# Altium schematic sheet INPUTS_OUTPUTS.SchDoc
size A; SheetNumber: 5; SheetTotal: 5
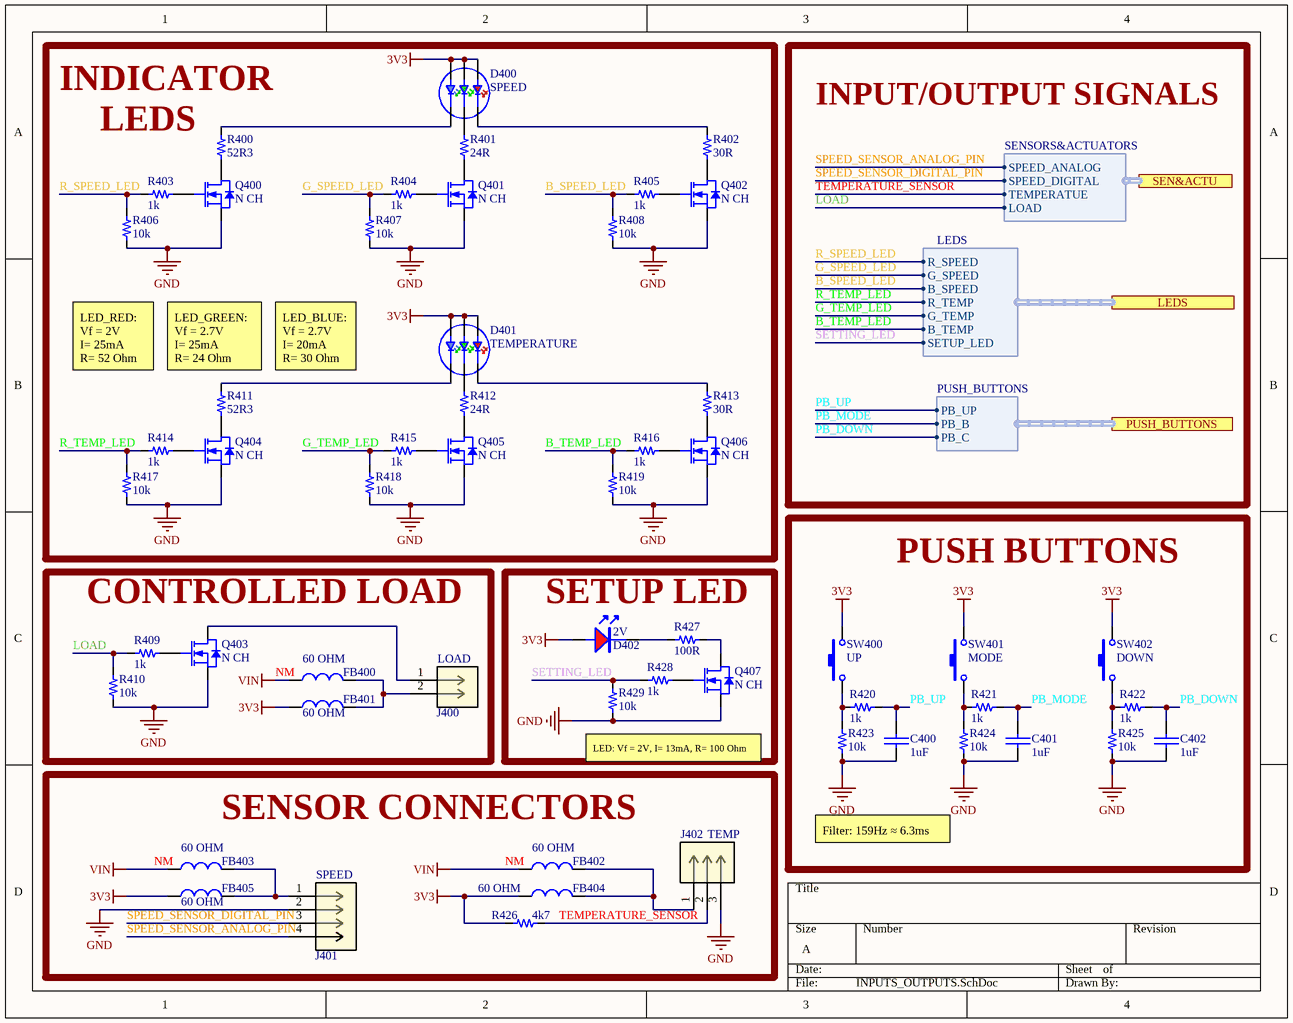
[diagram p0: INPUTS_OUTPUTS.SchDoc]

## Parts
C400  value 1uF  [0603_cap]  (hidden comment: 1uF 50V)
C401  value 1uF  [0603_cap]  (hidden comment: 1uF 50V)
C402  value 1uF  [0603_cap]  (hidden comment: 1uF 50V)
D400  SPEED  [RGB_NS_3.5X3.7]
D401  TEMPERATURE  [RGB_NS_3.5X3.7]
D402  2V  [0805_LED]
FB400  value 60 OHM  Usage: NM  [0603_fb]  (hidden comment: 60OHM 2A)
FB401  value 60 OHM  [0603_fb]  (hidden comment: 60OHM 2A)
FB402  value 60 OHM  Usage: NM  [0603_fb]  (hidden comment: 60OHM 2A)
FB403  value 60 OHM  Usage: NM  [0603_fb]  (hidden comment: 60OHM 2A)
FB404  value 60 OHM  [0603_fb]  (hidden comment: 60OHM 2A)
FB405  value 60 OHM  [0603_fb]  (hidden comment: 60OHM 2A)
J400  LOAD  [CON_2X1_TH_2.54MM]
J401  SPEED  [CON_4X1_TH_2.54MM]
J402  TEMP  [CON_3X1_TH_2.54MM]
Q400  N CH  [SOT_23_3]
Q401  N CH  [SOT_23_3]
Q402  N CH  [SOT_23_3]
Q403  N CH  [SOT_23_3]
Q404  N CH  [SOT_23_3]
Q405  N CH  [SOT_23_3]
Q406  N CH  [SOT_23_3]
Q407  N CH  [SOT_23_3]
R400  value 52R3  [0603_res]  (hidden comment: 52R3 1/10W)
R401  value 24R  [0603_res]  (hidden comment: 24R 1/10W)
R402  value 30R  [0603_res]  (hidden comment: 30 1/10W)
R403  value 1k  [0603_res]  (hidden comment: 1k 1/10W)
R404  value 1k  [0603_res]  (hidden comment: 1k 1/10W)
R405  value 1k  [0603_res]  (hidden comment: 1k 1/10W)
R406  value 10k  [0603_res]  (hidden comment: 10k 1/10W)
R407  value 10k  [0603_res]  (hidden comment: 10k 1/10W)
R408  value 10k  [0603_res]  (hidden comment: 10k 1/10W)
R409  value 1k  [0603_res]  (hidden comment: 1k 1/10W)
R410  value 10k  [0603_res]  (hidden comment: 10k 1/10W)
R411  value 52R3  [0603_res]  (hidden comment: 52R3 1/10W)
R412  value 24R  [0603_res]  (hidden comment: 24R 1/10W)
R413  value 30R  [0603_res]  (hidden comment: 30 1/10W)
R414  value 1k  [0603_res]  (hidden comment: 1k 1/10W)
R415  value 1k  [0603_res]  (hidden comment: 1k 1/10W)
R416  value 1k  [0603_res]  (hidden comment: 1k 1/10W)
R417  value 10k  [0603_res]  (hidden comment: 10k 1/10W)
R418  value 10k  [0603_res]  (hidden comment: 10k 1/10W)
R419  value 10k  [0603_res]  (hidden comment: 10k 1/10W)
R420  value 1k  [0603_res]  (hidden comment: 1k 1/10W)
R421  value 1k  [0603_res]  (hidden comment: 1k 1/10W)
R422  value 1k  [0603_res]  (hidden comment: 1k 1/10W)
R423  value 10k  [0603_res]  (hidden comment: 10k 1/10W)
R424  value 10k  [0603_res]  (hidden comment: 10k 1/10W)
R425  value 10k  [0603_res]  (hidden comment: 10k 1/10W)
R426  value 4k7  [0603_res]  (hidden comment: 4k7 1/10W)
R427  value 100R  [0603_res]  (hidden comment: 100R 1/10W)
R428  value 1k  [0603_res]  (hidden comment: 1k 1/10W)
R429  value 10k  [0603_res]  (hidden comment: 10k 1/10W)
SW400  UP  [Sw_PUSH_4.5x4.5x5mm]
SW401  MODE  [Sw_PUSH_4.5x4.5x5mm]
SW402  DOWN  [Sw_PUSH_4.5x4.5x5mm]

## Blocks framed on the sheet
PUSH BUTTONS: C400-C402 R420-R425 SW400-SW402
CONTROLLED LOAD: FB400 FB401 J400 Q403 R409 R410
SETUP LED: D402 Q407 R427-R429
SENSOR CONNECTORS: FB402-FB405 J401 J402 R426

## Ports
LEDS (harness LEDS, see main[3C], MCU[4C]), PUSH_BUTTONS (harness PUSH_BUTTONS, see main[3C], MCU[4C]), SEN&ACTU (harness SENSORS&ACTUATORS, see main[3C], MCU[4C])

## Harnesses
LEDS: R_SPEED, G_SPEED, B_SPEED, R_TEMP, G_TEMP, B_TEMP, SETUP_LED
SENSORS&ACTUATORS: SPEED_ANALOG, SPEED_DIGITAL, TEMPERATUE, LOAD
PUSH_BUTTONS: PB_UP, PB_B, PB_C

## Nets
3V3: D400.4 D400.5 D400.6 D401.4 D401.5 D401.6 D402.1(A) FB401.1 FB404.1 FB405.1 R426.1 SW400.2 SW401.2 SW402.2
GND: C400.1 C401.1 C402.1 J401.2 J402.3 Q400.2(S) Q401.2(S) Q402.2(S) Q403.2(S) Q404.2(S) Q405.2(S) Q406.2(S) Q407.2(S) R406.1 R407.1 R408.1 R410.1 R417.1 R418.1 R419.1 R423.1 R424.1 R425.1 R429.1
VIN: FB400.1 FB402.1 FB403.1
B_SPEED_LED: R405.1 R408.2 ; port LEDS.B_SPEED
B_TEMP_LED: R416.1 R419.2 ; port LEDS.B_TEMP
G_SPEED_LED: R404.1 R407.2 ; port LEDS.G_SPEED
G_TEMP_LED: R415.1 R418.2 ; port LEDS.G_TEMP
LOAD: R409.1 R410.2 ; port SEN&ACTU.LOAD
PB_DOWN: C402.2 R422.2 ; port PUSH_BUTTONS.PB_C
PB_MODE: C401.2 R421.2 ; port PUSH_BUTTONS.PB_B
PB_UP: C400.2 R420.2 ; port PUSH_BUTTONS.PB_UP
R_SPEED_LED: R403.1 R406.2 ; port LEDS.R_SPEED
R_TEMP_LED: R414.1 R417.2 ; port LEDS.R_TEMP
SETTING_LED: R428.1 R429.2 ; port LEDS.SETUP_LED
SPEED_SENSOR_ANALOG_PIN: J401.4 ; port SEN&ACTU.SPEED_ANALOG
SPEED_SENSOR_DIGITAL_PIN: J401.3 ; port SEN&ACTU.SPEED_DIGITAL
TEMPERATURE_SENSOR: J402.2 R426.2 ; port SEN&ACTU.TEMPERATUE
NetD400_1: D400.1 R400.2
NetD400_2: D400.2 R401.2
NetD400_3: D400.3 R402.2
NetD401_1: D401.1 R411.2
NetD401_2: D401.2 R412.2
NetD401_3: D401.3 R413.2
NetD402_2: D402.2 R427.2
NetFB400_2: FB400.2 FB401.2 J400.2
NetFB402_2: FB402.2 FB404.2 J402.1
NetFB403_2: FB403.2 FB405.2 J401.1
NetJ400_1: J400.1 Q403.3(D)
NetQ400_1: Q400.1(G) R403.2
NetQ400_3: Q400.3(D) R400.1
NetQ401_1: Q401.1(G) R404.2
NetQ401_3: Q401.3(D) R401.1
NetQ402_1: Q402.1(G) R405.2
NetQ402_3: Q402.3(D) R402.1
NetQ403_1: Q403.1(G) R409.2
NetQ404_1: Q404.1(G) R414.2
NetQ404_3: Q404.3(D) R411.1
NetQ405_1: Q405.1(G) R415.2
NetQ405_3: Q405.3(D) R412.1
NetQ406_1: Q406.1(G) R416.2
NetQ406_3: Q406.3(D) R413.1
NetQ407_1: Q407.1(G) R428.2
NetQ407_3: Q407.3(D) R427.1
NetR420_1: R420.1 R423.2 SW400.1
NetR421_1: R421.1 R424.2 SW401.1
NetR422_1: R422.1 R425.2 SW402.1

## Notes on the sheet
- (near R400) INDICATOR
- LEDS
- INPUT/OUTPUT SIGNALS
- LED_RED:
  Vf = 2V
  I= 25mA
  R= 52 Ohm
- (near R411) LED_GREEN:
  Vf = 2.7V
  I= 25mA
  R= 24 Ohm
- LED_BLUE:
  Vf = 2.7V
  I= 20mA
  R= 30 Ohm
- LED: Vf = 2V, I= 13mA, R= 100 Ohm
- Filter: 159Hz ≈ 6.3ms

## Library data of the parts
C400-C402 = Cap_1uF_0603_50V: 50V 1uF X5R ±10% 0603 Multilayer Ceramic Capacitors MLCC - SMD/SMT ROHS; Manufacturer: Samsung Electro-Mechanics; Manufacturer Part Number: CL10A105KB8NNNC; Supplier 1: LCSC; Supplier Part Number 1: C15849; ComponentLink1Description: LCSC; ComponentLink1URL: https://www.lcsc.com/product-detail/Multilayer-Ceramic-Capacitors-MLCC-SMD-SMT_Samsung-Electro-Mechanics-CL10A105KB8NNNC_C15849.html
D400 D401 = LED_RGB_3535_SMD: -30℃~+85℃ RGB 110° 3535(mm) Light Emitting Diodes (LED) ROHS; Manufacturer: Foshan NationStar Optoelectronics; Manufacturer Part Number: RS-3535MWAM; Supplier 1: LCSC; Supplier Part Number 1: C842778; ComponentLink1Description: LCSC; ComponentLink1URL: https://www.lcsc.com/product-detail/Light-Emitting-Diodes-LED_Foshan-NationStar-Optoelectronics-RS-3535MWAM_C842778.html
D402 = LED_0805_RED: LED RED CLEAR 0805 SMD; Manufacturer: XINGLIGHT; Manufacturer Part Number: XL-2012SURC; Supplier 1: LCSC; Supplier Part Number 1: C965812; ComponentLink1Description: LCSC; ComponentLink1URL: https://www.lcsc.com/product-detail/Light-Emitting-Diodes-LED_XINGLIGHT-XL-2012SURC_C965812.html
FB400-FB405 = FB_60_0603_2A: 2A 1 100mΩ 60Ω@100MHz ±25% 0603 Ferrite Beads ROHS; Manufacturer: TAI-TECH; Manufacturer Part Number: HCB1608KF-600T20; ComponentLink1Description: LCSC; ComponentLink1URL: https://www.lcsc.com/product-detail/Ferrite-Beads_TAI-TECH-HCB1608KF-600T20_C369516.html; Supplier 1: LCSC; Supplier Part Number 1: C369516
J400 = Con_2x1_TH_2.54mm: CONN HEADER VERT 2POS 2.54MM; Manufacturer: Amphenol ICC (FCI); Manufacturer Part Number: 10129378-902001BLF; Supplier 1: Digi-Key; Supplier Part Number 1: 10129378-902001BLF-ND; Value: *; ComponentLink1Description: Digi-Key; ComponentLink1URL: https://www.digikey.com/en/products/detail/amphenol-cs-fci/10129378-902001BLF/7915924?s=N4IgTCBcDaIIwAY5gJwGYDsAOAtChYCSAQgDIBiIAugL5A
J401 = Con_4X1_TH_2.54mm: CONN HEADER VERT 4POS 2.54MM; Manufacturer: Amphenol ICC (FCI); Manufacturer Part Number: 10129378-904001BLF; Supplier 1: Digi-Key; Supplier Part Number 1: 10129378-904001BLF-ND; Value: *; ComponentLink1Description: Digi-Key; ComponentLink1URL: https://www.digikey.com/en/products/detail/amphenol-cs-fci/10129378-904001BLF/7915932?s=N4IgTCBcDaIIwAY5gJwGYDsAOAtChALAkgEIAyAYiALoC%2BQA
J402 = Con_3X1_TH_2.54mm: CONN HEADER VERT 3POS 2.54MM; Manufacturer: Amphenol ICC (FCI); Manufacturer Part Number: 10129378-903001BLF; Supplier 1: Digi-Key; Supplier Part Number 1: 10129378-903001BLF-ND; Value: *; ComponentLink1Description: Digi-Key; ComponentLink1URL: https://www.digikey.com/en/products/detail/amphenol-cs-fci/10129378-903001BLF/7915928
Q400-Q407 = Q_NFET_20V_3.2A_SOT23: MOSFET N-CH 20V SOT23; Manufacturer: Doeshare; Manufacturer Part Number: DN2302S; Supplier 1: LCSC; Supplier Part Number 1: C2931750; ComponentLink1Description: LCSC; ComponentLink1URL: https://www.lcsc.com/product-detail/MOSFETs_Doeshare-DN2302S_C2931750.html
R400 R411 = Res_52R3_0603_1/10W_1: RES SMD 52R3 OHM 1% 1/10W 0603; Manufacturer: FOJAN; Manufacturer Part Number: FRC0603F52R3TS; ComponentLink1URL: https://www.lcsc.com/product-detail/Chip-Resistor-Surface-Mount_FOJAN-FRC0603F52R3TS_C2998074.html; Supplier 1: LCSC; Supplier Part Number 1: C2998074; ComponentLink1Description: LCSC
R401 R412 = Res_24R_0603_1/10W: RES SMD 24R OHM 5% 1/10W 0603; Manufacturer: FOJAN; Manufacturer Part Number: FRC0603J240 TS; ComponentLink1URL: https://www.lcsc.com/product-detail/Chip-Resistor-Surface-Mount_FOJAN-FRC0603J240-TS_C2907132.html; Supplier 1: LCSC; Supplier Part Number 1: C2907132; ComponentLink1Description: LCSC
R402 R413 = Res_30R_0603_1/10W: RES SMD 30R OHM 1% 1/10W 0603; Manufacturer: FOJAN; Manufacturer Part Number: FRC0603F30R0TS; ComponentLink1URL: https://www.lcsc.com/product-detail/Chip-Resistor-Surface-Mount_FOJAN-FRC0603F30R0TS_C2907026.html; Supplier 1: LCSC; Supplier Part Number 1: C2907026; ComponentLink1Description: LCSC
R403-R405 R409 R414-R416 R420-R422 R428 = Res_1k_0603_1/10W: RES SMD 1k OHM 5% 1/10W 0603; Manufacturer: FOJAN; Manufacturer Part Number: FRC0603J102 TS; ComponentLink1URL: https://www.lcsc.com/product-detail/Chip-Resistor-Surface-Mount_FOJAN-FRC0603J102-TS_C2907113.html; Supplier 1: LCSC; Supplier Part Number 1: C2907113; ComponentLink1Description: LCSC
R406-R408 R410 R417-R419 R423-R425 R429 = Res_10k_0603_1/10W: RES SMD 10k OHM 5% 1/10W 0603; Manufacturer: FOJAN; Manufacturer Part Number: FRC0603J103TS; ComponentLink1URL: https://www.lcsc.com/product-detail/Chip-Resistor-Surface-Mount_FOJAN-FRC0603J103TS_C2930027.html; Supplier 1: LCSC; Supplier Part Number 1: C2930027; ComponentLink1Description: LCSC
R426 = Res_4k7_0603_1/10W: RES SMD 4k7 OHM 5% 1/10W 0603; Manufacturer: FOJAN; Manufacturer Part Number: FRC0603J472 TS; ComponentLink1URL: https://www.lcsc.com/product-detail/Chip-Resistor-Surface-Mount_FOJAN-FRC0603J472-TS_C2907166.html; Supplier 1: LCSC; Supplier Part Number 1: C2907166; ComponentLink1Description: LCSC
R427 = Res_100R_0603_1/10W: RES SMD 100R OHM 5% 1/10W 0603; Manufacturer: FOJAN; Manufacturer Part Number: FRC0603J101 TS; ComponentLink1URL: https://www.lcsc.com/product-detail/Chip-Resistor-Surface-Mount_FOJAN-FRC0603J101-TS_C2907089.html; Supplier 1: LCSC; Supplier Part Number 1: C2907089; ComponentLink1Description: LCSC
SW400-SW402 = Sw_PUSH_4.5x4.5x5.0xmm: SWITCH TACTILE SPST-NO 0.05A 12V; Manufacturer: BZCN; Manufacturer Part Number: TSC015A05026A; Supplier 1: LCSC; Supplier Part Number 1: C2888509; Last modified by: N-A.Potosi; Last modified date: 20190222; ComponentLink1Description: LCSC; ComponentLink1URL: https://www.lcsc.com/product-detail/Tactile-Switches_BZCN-TSC015A05026A_C2888509.html